# Altium schematic sheet Mechanical.SchDoc
size Letter; CompanyName: Ploopy Corporation; Organization: Ploopy Corporation; Address1: 137-1140 Burnhamthorpe Road W; Address2: Mississauga; Address3: Ontario; Address4: Canada L5C 0A3; DocumentNumber: 6; Revision: R1.001; SheetNumber: 6; SheetTotal: 9
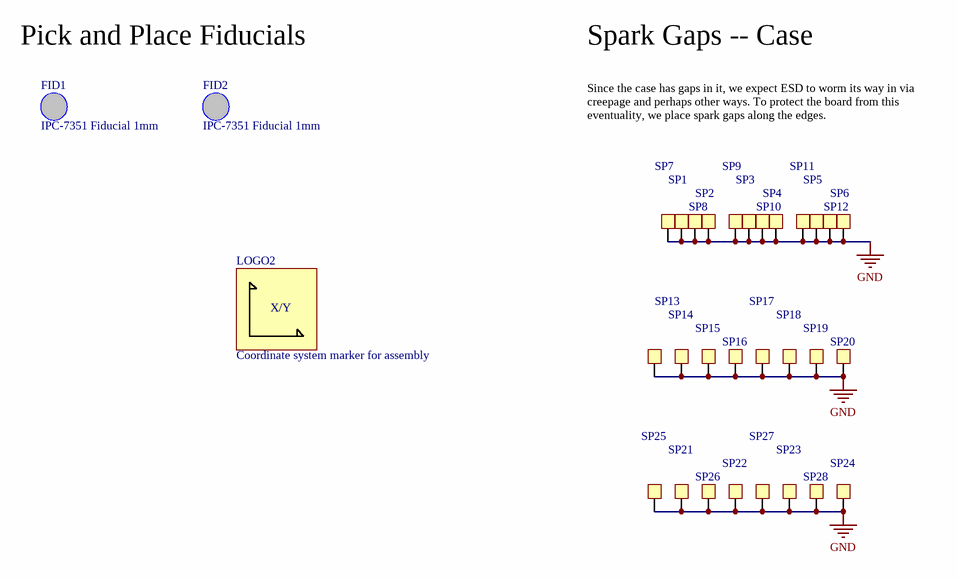
[diagram p0: Mechanical.SchDoc]

## Parts
FID1  IPC-7351 Fiducial 1mm  [FIDUCIAL_1.5]
FID2  IPC-7351 Fiducial 1mm  [FIDUCIAL_1.5]
LOGO2  Coordinate system marker for assembly  [Coordinate System]  (no BOM)
SP1  Spark Gap  [SparkGap]  (value not drawn)  (no BOM)
SP2  Spark Gap  [SparkGap]  (value not drawn)  (no BOM)
SP3  Spark Gap  [SparkGap]  (value not drawn)  (no BOM)
SP4  Spark Gap  [SparkGap]  (value not drawn)  (no BOM)
SP5  Spark Gap  [SparkGap]  (value not drawn)  (no BOM)
SP6  Spark Gap  [SparkGap]  (value not drawn)  (no BOM)
SP7  Spark Gap  [SparkGap]  (value not drawn)  (no BOM)
SP8  Spark Gap  [SparkGap]  (value not drawn)  (no BOM)
SP9  Spark Gap  [SparkGap]  (value not drawn)  (no BOM)
SP10  Spark Gap  [SparkGap]  (value not drawn)  (no BOM)
SP11  Spark Gap  [SparkGap]  (value not drawn)  (no BOM)
SP12  Spark Gap  [SparkGap]  (value not drawn)  (no BOM)
SP13  Spark Gap  [SparkGap]  (value not drawn)  (no BOM)
SP14  Spark Gap  [SparkGap]  (value not drawn)  (no BOM)
SP15  Spark Gap  [SparkGap]  (value not drawn)  (no BOM)
SP16  Spark Gap  [SparkGap]  (value not drawn)  (no BOM)
SP17  Spark Gap  [SparkGap]  (value not drawn)  (no BOM)
SP18  Spark Gap  [SparkGap]  (value not drawn)  (no BOM)
SP19  Spark Gap  [SparkGap]  (value not drawn)  (no BOM)
SP20  Spark Gap  [SparkGap]  (value not drawn)  (no BOM)
SP21  Spark Gap  [SparkGap]  (value not drawn)  (no BOM)
SP22  Spark Gap  [SparkGap]  (value not drawn)  (no BOM)
SP23  Spark Gap  [SparkGap]  (value not drawn)  (no BOM)
SP24  Spark Gap  [SparkGap]  (value not drawn)  (no BOM)
SP25  Spark Gap  [SparkGap]  (value not drawn)  (no BOM)
SP26  Spark Gap  [SparkGap]  (value not drawn)  (no BOM)
SP27  Spark Gap  [SparkGap]  (value not drawn)  (no BOM)
SP28  Spark Gap  [SparkGap]  (value not drawn)  (no BOM)

## Nets
GND: SP1.1 SP2.1 SP3.1 SP4.1 SP5.1 SP6.1 SP7.1 SP8.1 SP9.1 SP10.1 SP11.1 SP12.1 SP13.1 SP14.1 SP15.1 SP16.1 SP17.1 SP18.1 SP19.1 SP20.1 SP21.1 SP22.1 SP23.1 SP24.1 SP25.1 SP26.1 SP27.1 SP28.1

Not connected (* = marked no-connect by the designer): FID1 1; FID2 1

## Notes on the sheet
- Pick and Place Fiducials
- Spark Gaps -- Case
- Since the case has gaps in it, we expect ESD to worm its way in via creepage and perhaps other ways. To protect the board from this eventuality, we place spark gaps along the edges.
- Copyright Ploopy Corporation 2021
- Licensed under the CERN-OHL-S v2
- http://ohwr.org/cernohl
- Title:
- PCB:
- Version:
- Ploopy Corporation
- Mississauga ON L5C 0A3
- 137-1140 Burnhamthorpe Road W
- Date:
- Time:
- Sheet
- of
- Canada
- (in symbol CoordinateSystem) X/Y

## Library data of the parts
FID1 FID2 = FIDUCIAL_1.5: PNP-Nzl: 2; PNP-dx: 0; PNP-X: 4; PNP-A: 1; PNP-Thk: 1.02; PNP-TS: 70; PNP-Type: MARK1; PNP-dy: 0; PNP-Y: 4; PNP-Pt: 0; PNP-W: 0; PNP-Lv: 1; PNP-Level: 1; PNP-Voff: 0; PNP-FeedType: Fiducial; PNP-TapeWidth: 0; PNP-PlacePriority: 0; PNP-TapeIndex: 0; PNP-da: 0
LOGO2 = CoordinateSystem
SP1-SP28 = Spark Gap: Open square pad for spark gapping; PNP-Nzl: 2; PNP-dx: 0; PNP-X: 1; PNP-TS: 70; PNP-Type: CHI; PNP-FeedType: Tape; PNP-TapeWidth: 8; PNP-dy: 0; PNP-Y: 1; PNP-A: 0; PNP-Pt: 0; PNP-W: 0; PNP-Thk: 1; PNP-Lv: 1; PNP-Level: 1; PNP-Voff: 0; PNP-PlacePriority: 1; PNP-TapeIndex: 1; PNP-da: 0